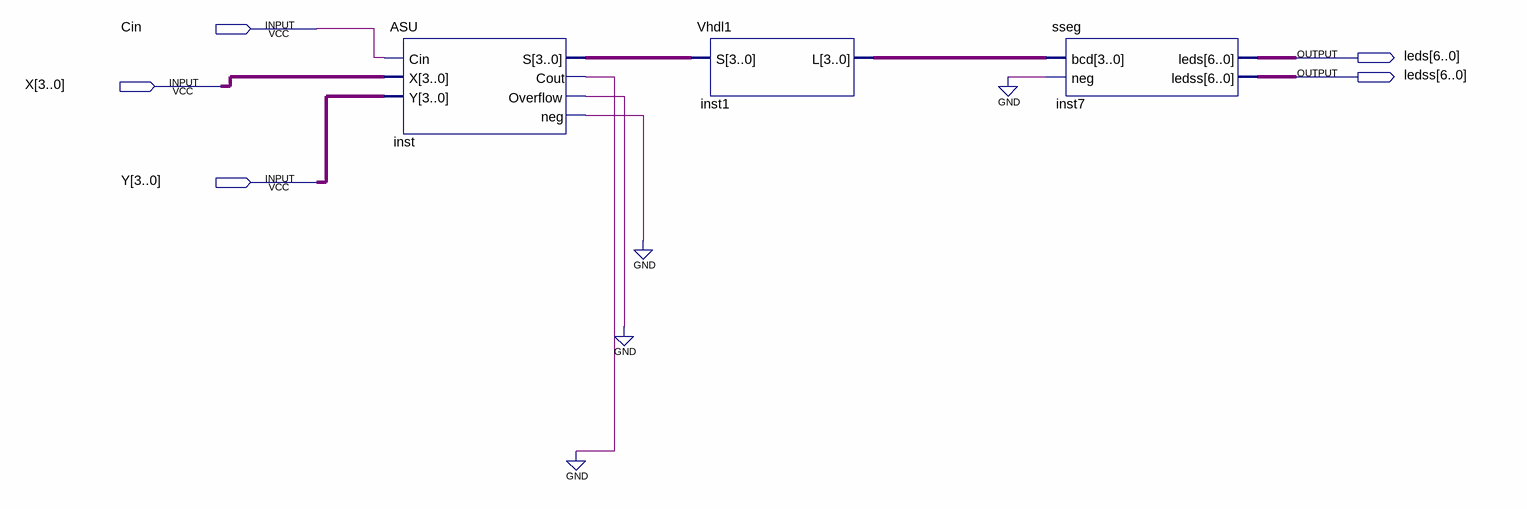
[diagram p0: schematic sheet]
// Quartus schematic TEST.bdf as structural Verilog: 3 symbols, 5 pins
module TEST (
  input  Cin,
  input  [3:0] X,
  input  [3:0] Y,
  output [6:0] leds,
  output [6:0] ledss
);

  wire inst_cout, inst_neg, inst_overflow;
  wire [3:0] inst1_l, inst_s;

  ASU inst (.Cin(Cin), .X(X), .Y(Y), .S(inst_s), .Cout(inst_cout), .Overflow(inst_overflow), .neg(inst_neg));
  Vhdl1 inst1 (.S(inst_s), .L(inst1_l));
  sseg inst7 (.bcd(inst1_l), .neg(1'b0), .leds(leds), .ledss(ledss));
  // also tied to GND on the sheet: {inst_cout, inst_overflow, inst_neg}
endmodule
